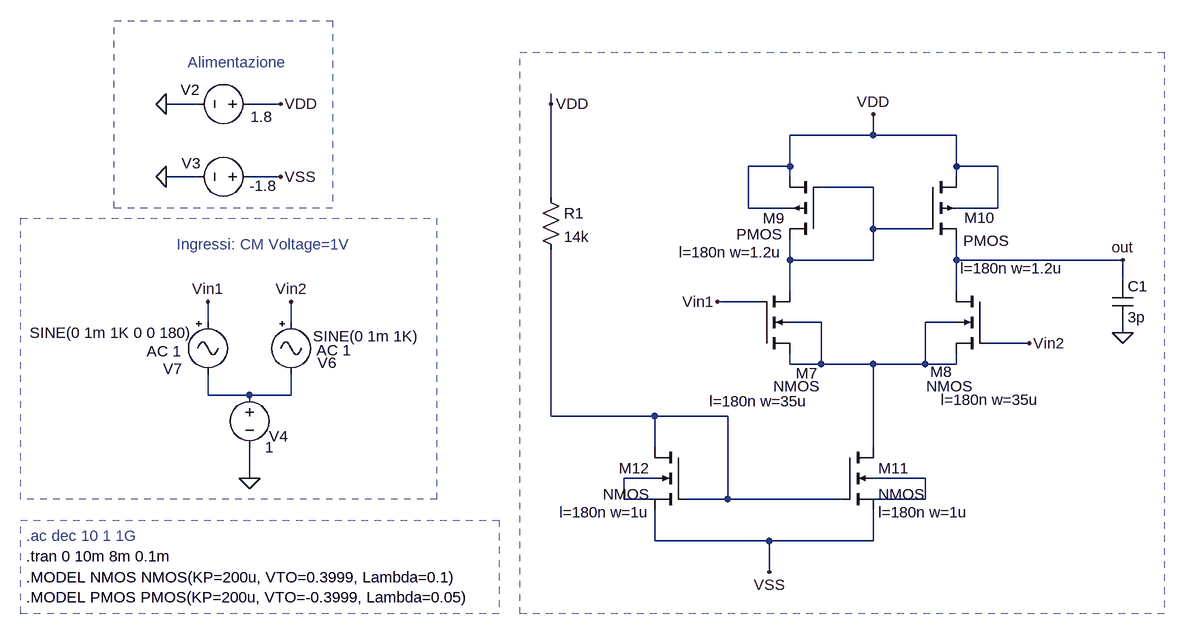
[diagram p0: schematic Differential_Pair_with_Active_Load.asc]
Differential_Pair_with_Active_Load.asc, the LTspice schematic file:
Version 4
SHEET 1 2436 1516
WIRE -848 -304 -896 -304
WIRE -720 -304 -768 -304
WIRE -304 -304 -304 -320
WIRE 192 -256 192 -288
WIRE 192 -256 64 -256
WIRE 320 -256 192 -256
WIRE 64 -208 64 -256
WIRE 64 -208 0 -208
WIRE 320 -208 320 -256
WIRE 384 -208 320 -208
WIRE -848 -192 -896 -192
WIRE -720 -192 -768 -192
WIRE 64 -192 64 -208
WIRE 320 -192 320 -208
WIRE 192 -176 112 -176
WIRE -304 -160 -304 -304
WIRE 0 -144 0 -208
WIRE 64 -144 0 -144
WIRE 384 -144 384 -208
WIRE 384 -144 320 -144
WIRE 192 -112 192 -176
WIRE 272 -112 192 -112
WIRE 64 -64 64 -96
WIRE 192 -64 192 -112
WIRE 192 -64 64 -64
WIRE 320 -64 320 -96
WIRE 576 -64 320 -64
WIRE 576 -32 576 -64
WIRE 64 -16 64 -64
WIRE 320 -16 320 -64
WIRE 16 0 -48 0
WIRE -832 32 -832 0
WIRE -704 32 -704 0
WIRE 112 32 64 32
WIRE 320 32 272 32
WIRE 576 48 576 32
WIRE 432 64 368 64
WIRE 64 96 64 80
WIRE 112 96 112 32
WIRE 112 96 64 96
WIRE 192 96 112 96
WIRE 272 96 272 32
WIRE 272 96 192 96
WIRE 320 96 320 80
WIRE 320 96 272 96
WIRE -832 144 -832 112
WIRE -768 144 -832 144
WIRE -704 144 -704 112
WIRE -704 144 -768 144
WIRE -304 176 -304 -80
WIRE -144 176 -304 176
WIRE -32 176 -144 176
WIRE -144 224 -144 176
WIRE 192 224 192 96
WIRE -768 272 -768 224
WIRE -144 272 -192 272
WIRE 272 272 192 272
WIRE -192 304 -192 272
WIRE -144 304 -192 304
WIRE -32 304 -32 176
WIRE -32 304 -96 304
WIRE 144 304 -32 304
WIRE 272 304 272 272
WIRE 272 304 192 304
WIRE -144 368 -144 320
WIRE 32 368 -144 368
WIRE 192 368 192 320
WIRE 192 368 32 368
WIRE 32 416 32 368
FLAG -896 -304 0
FLAG -720 -304 VDD
FLAG -304 -304 VDD
FLAG -896 -192 0
FLAG -720 -192 VSS
FLAG 32 416 VSS
FLAG -48 0 Vin1
FLAG 432 64 Vin2
FLAG -768 272 0
FLAG 192 -288 VDD
FLAG 576 48 0
FLAG 576 -64 out
FLAG -832 0 Vin1
FLAG -704 0 Vin2
SYMBOL voltage -752 -304 R90
WINDOW 0 -6 107 VBottom 2
WINDOW 3 4 -3 VTop 2
SYMATTR InstName V2
SYMATTR Value 1.8
SYMBOL res -320 -176 R0
SYMATTR InstName R1
SYMATTR Value 14k
SYMBOL voltage -752 -192 R90
WINDOW 123 0 0 Left 0
WINDOW 39 0 0 Left 0
WINDOW 0 -21 91 VRight 2
WINDOW 3 14 -26 VRight 2
SYMATTR InstName V3
SYMATTR Value -1.8
SYMBOL voltage -768 128 R0
WINDOW 0 30 79 Left 2
WINDOW 123 0 0 Left 0
WINDOW 39 0 0 Left 0
SYMATTR InstName V4
SYMATTR Value 1
SYMBOL cap 560 -32 R0
SYMATTR InstName C1
SYMATTR Value 3p
SYMBOL Misc\\signal -704 16 R0
WINDOW 123 39 59 Left 2
WINDOW 39 0 0 Left 0
WINDOW 0 41 78 Left 2
WINDOW 3 34 37 Left 2
SYMATTR Value2 AC 1
SYMATTR InstName V6
SYMATTR Value SINE(0 1m 1K)
SYMBOL Misc\\signal -832 16 R0
WINDOW 123 -94 60 Left 2
WINDOW 39 0 0 Left 0
WINDOW 0 -69 87 Left 2
WINDOW 3 -274 32 Left 2
SYMATTR Value2 AC 1
SYMATTR InstName V7
SYMATTR Value SINE(0 1m 1K 0 0 180)
SYMBOL nmos4 16 80 M180
WINDOW 0 57 -30 Left 2
WINDOW 3 22 -50 Left 2
WINDOW 123 -76 -73 Left 2
SYMATTR InstName M7
SYMATTR Value2 l=180n w=35u
SYMBOL nmos4 368 -16 M0
WINDOW 0 54 124 Left 2
WINDOW 3 22 146 Left 2
WINDOW 123 -80 167 Left 2
SYMATTR InstName M8
SYMATTR Value2 l=180n w=35u
SYMBOL pmos4 112 -96 R180
WINDOW 3 60 8 Left 2
WINDOW 123 60 -20 Left 2
SYMATTR InstName M9
SYMATTR Value2 l=180n w=1.2u
SYMBOL pmos4 272 -192 R0
WINDOW 0 60 63 Left 2
WINDOW 3 59 98 Left 2
WINDOW 123 54 141 Left 2
SYMATTR InstName M10
SYMATTR Value2 l=180n w=1.2u
SYMBOL nmos4 144 224 R0
WINDOW 123 56 100 Left 2
SYMATTR InstName M11
SYMATTR Value2 l=180n w=1u
SYMBOL nmos4 -96 224 M0
WINDOW 123 56 100 Left 2
SYMATTR InstName M12
SYMATTR Value2 l=180n w=1u
TEXT -880 -88 Left 2 ;Ingressi: CM Voltage=1V
TEXT -1112 392 Left 2 !.tran 0 10m 8m 0.1m
TEXT -1112 424 Left 2 !.MODEL NMOS NMOS(KP=200u, VTO=0.3999, Lambda=0.1)\n.MODEL PMOS PMOS(KP=200u, VTO=-0.3999, Lambda=0.05)
TEXT -712 -368 Right 2 ;Alimentazione
TEXT -1112 360 Left 2 ;.ac dec 10 1 1G
RECTANGLE Normal -640 -144 -976 -432 2
RECTANGLE Normal -480 304 -1120 -128 2
RECTANGLE Normal 640 480 -352 -384 2
RECTANGLE Normal -384 480 -1120 336 2

The netlist it stands for:
* Differential_Pair_with_Active_Load.asc
V2 VDD 0 1.8
R1 VDD N004 14k
V3 VSS 0 -1.8
V4 N003 0 1
C1 out 0 3p
V6 Vin2 N003 SINE(0 1m 1K) AC 1
V7 Vin1 N003 SINE(0 1m 1K 0 0 180) AC 1
M7 N002 Vin1 N001 N002 NMOS l=180n w=35u
M8 out Vin2 N002 N002 NMOS l=180n w=35u
M9 N001 N001 VDD VDD PMOS l=180n w=1.2u
M10 VDD N001 out VDD PMOS l=180n w=1.2u
M11 N002 N004 VSS N006 NMOS l=180n w=1u
M12 N004 N004 VSS N005 NMOS l=180n w=1u
.model NMOS NMOS
.model PMOS PMOS
.lib standard.mos
* Ingressi: CM Voltage=1V
.tran 0 10m 8m 0.1m
.MODEL NMOS NMOS(KP=200u, VTO=0.3999, Lambda=0.1)
.MODEL PMOS PMOS(KP=200u, VTO=-0.3999, Lambda=0.05)
* Alimentazione
* .ac dec 10 1 1G
.backanno
.end